# EAGLE design tgam_breakout (EAGLE 6.4)
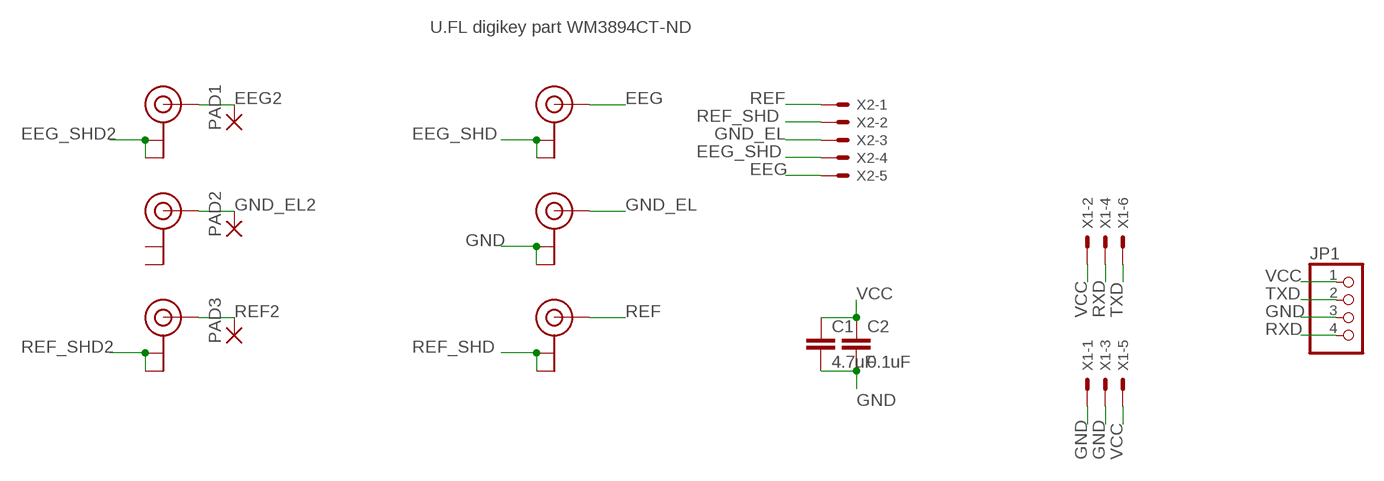
[diagram p0: schematic, sheet 1]

## Parts
C1  4.7uF  C-EUC0805  [C0805]
C2  0.1uF  C-EUC0805  [C0805]
EEG  U.FL  [U.FL]
EEG_EL  U.FL  [U.FL]
GND_EL  U.FL  [U.FL]
GND_ELEL  U.FL  [U.FL]
JP1  PINHD-1X4  [1X04]
PAD1  SMD5  [SMD2,54-5,08]
PAD2  SMD5  [SMD2,54-5,08]
PAD3  SMD5  [SMD2,54-5,08]
REF  U.FL  [U.FL]
REF_EL  U.FL  [U.FL]
X1  332-06  [332-06]
X2  332-10  [2MM5SIL]

## Nets
EEG: EEG.P$3(SIGNAL) X2.9
EEG2: EEG_EL.P$3(SIGNAL) PAD1.1(P)
EEG_SHD: EEG.P$1(GND) EEG.P$2(GND) X2.7
EEG_SHD2: EEG_EL.P$1(GND) EEG_EL.P$2(GND)
GND: C1.2 C2.2 GND_EL.P$1(GND) GND_EL.P$2(GND) JP1.3 X1.1 X1.3
GND_EL: GND_EL.P$3(SIGNAL) X2.5
GND_EL2: GND_ELEL.P$3(SIGNAL) PAD2.1(P)
REF: REF.P$3(SIGNAL) X2.1
REF2: PAD3.1(P) REF_EL.P$3(SIGNAL)
REF_SHD: REF.P$1(GND) REF.P$2(GND) X2.3
REF_SHD2: REF_EL.P$1(GND) REF_EL.P$2(GND)
RXD: JP1.4 X1.4
TXD: JP1.2 X1.6
VCC: C1.1 C2.1 JP1.1 X1.2 X1.5
Unconnected: GND_ELEL.P$1(GND) GND_ELEL.P$2(GND)

## Notes on the sheet
- U.FL digikey part WM3894CT-ND

## Library data of the parts
C1 C2 = rcl:C-EU: CAPACITOR, European symbol
EEG EEG_EL GND_EL GND_ELEL REF REF_EL = SparkFun-Connectors:U.FL: SMD antenna connector- WRL-09144
JP1 = pinhead:PINHD-1X4: PIN HEADER
PAD1-PAD3 = wirepad:SMD5: SMD PAD
X1 = con-garry:332-06: 6 Pin - 2mm Dual Row Source: www.mpe-connector.de / garry_shortform_2012.pdf
X2 = 2mm:332-10: 5 Pin - 2mm Single Row Source: www.mpe-connector.de / garry_shortform_2012.pdf

## Board
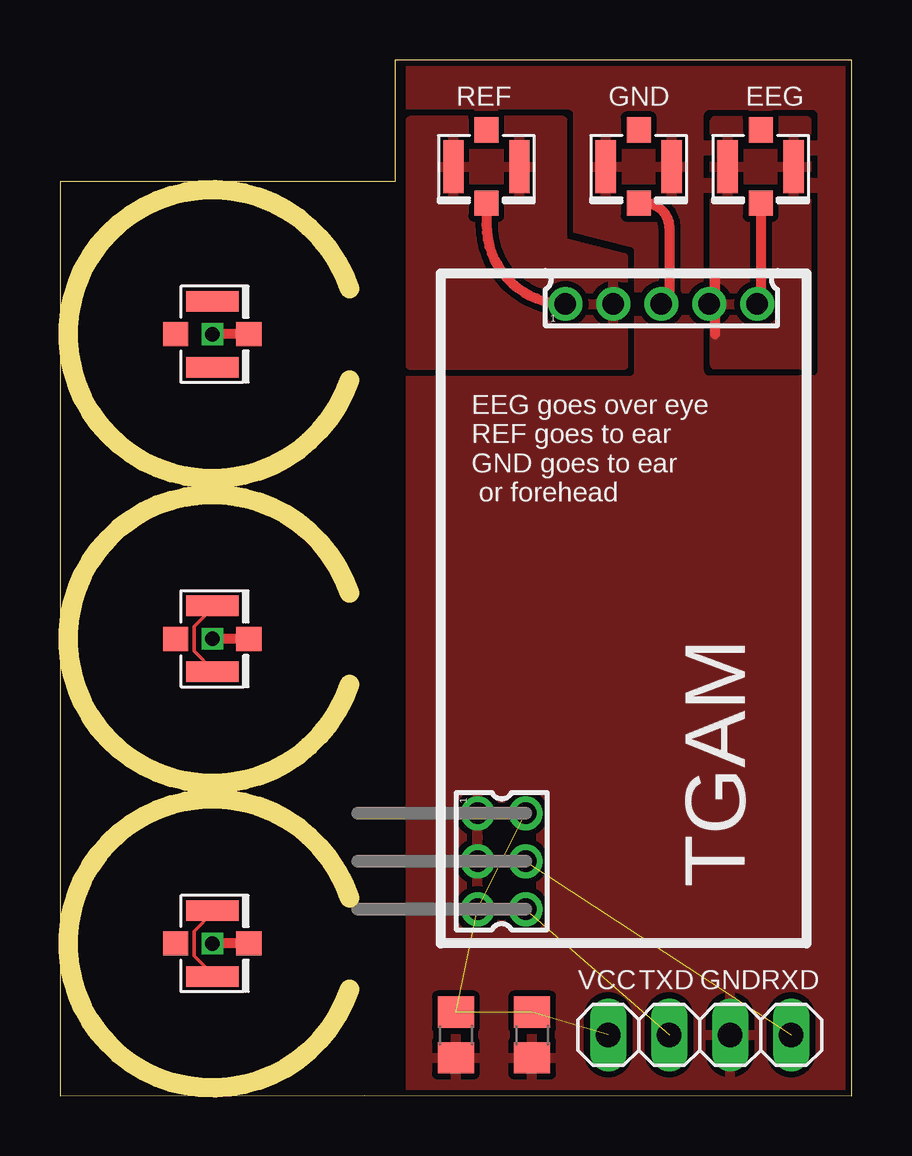
[diagram p1: board, top side]
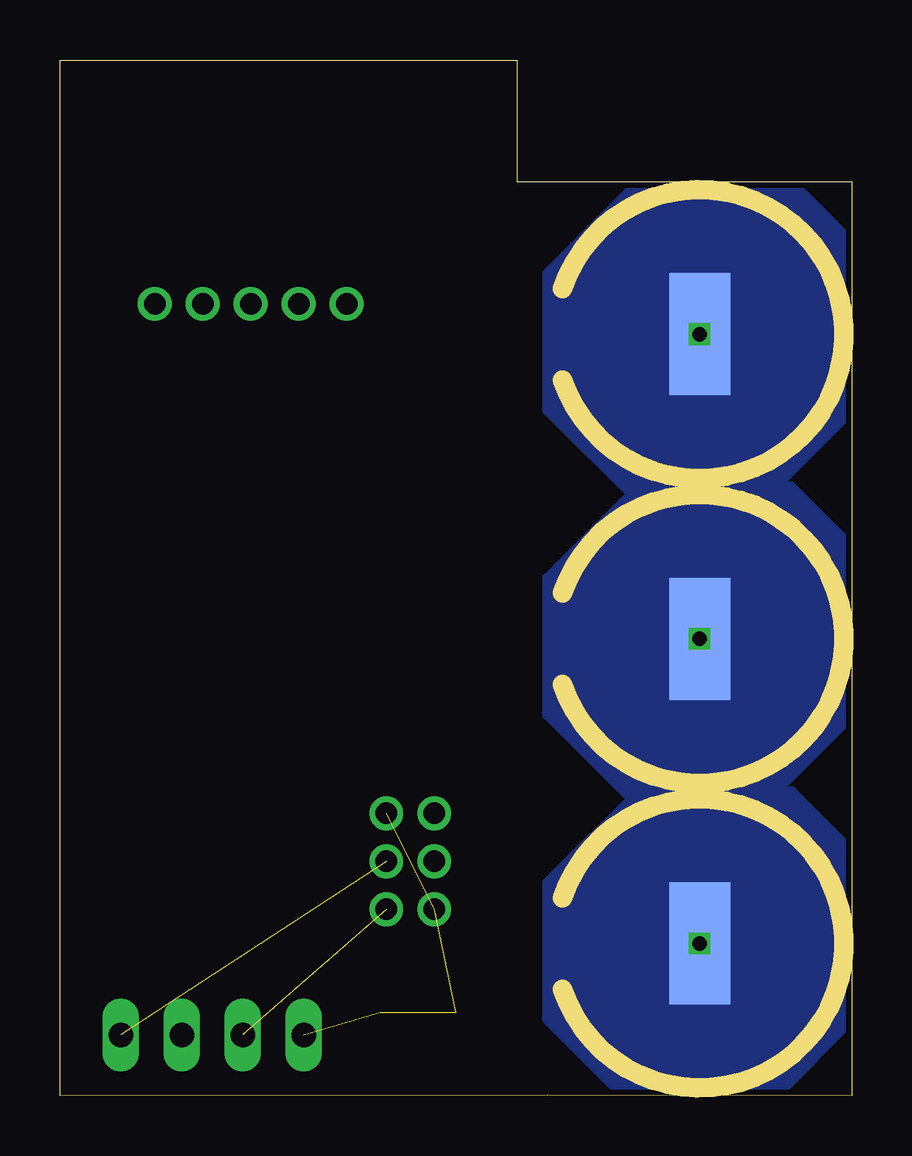
[diagram p2: board, bottom side, seen from below]

Size 33.02 x 43.18 mm. Coordinates in mm from the lower left corner, seen from the top.
Outline: 0,0 12.7,0.02 33.02,0 33.02,43.18 13.97,43.18 13.97,38.1 0,38.1 0,0
Copper layers (1*16): Top 0.035mm / dielectric 1.5mm / Bottom 0.035mm
Design rules "Fusion_eagle_rule_v1.1": minimum track width 6mil, minimum drill 12mil, track to track 6mil, track to pad 6mil, pad to pad 6mil, via to via 6mil, smd to smd 0mil, copper to edge 10mil, drill to drill 10mil, minimum pad ring 10mil, minimum via ring 6mil, stop-mask expansion 2mil, vias tented up to drill 100mil, thermal gap 10mil
Milling: 3 lines

### Footprints (pad centres in the part's own frame; a part is rotated, then mirrored left to right if it is on the bottom)
C0805 = smd 1.3 x 1.5: 1 -0.95,0; 2 0.95,0
U.FL = smd 2.2 x 0.85: P$1 0,1.375; P$2 0,-1.375 | smd 1.05 x 1: P$3 1.525,0; P$4 -1.525,0
1X04 = drill 1.016 long: 1 -3.81,0; 2 -1.27,0; 3 1.27,0; 4 3.81,0
SMD2,54-5,08 = smd 2.54 x 5.08: 1 0,0
332-06 = drill 0.9 pad 1.27: 1 -2,-1; 2 -2,1; 3 0,-1; 4 0,1; 5 2,-1; 6 2,1
2MM5SIL = drill 0.9 pad 1.27: 1 -4,-1; 3 -2,-1; 5 0,-1; 7 2,-1; 9 4,-1

### Placement (x,y rotation side)
C1  16.51,2.54 270 top
C2  19.68,2.54 270 top
EEG  29.21,38.73 270 top
EEG_EL  6.35,19.05 0 top
GND_EL  24.13,38.73 270 top
GND_ELEL  6.35,31.75 0 top
JP1  26.67,2.54 0 top
PAD1  6.35,19.05 0 bottom
PAD2  6.35,31.75 0 bottom
PAD3  6.35,6.35 0 bottom
REF  17.78,38.73 270 top
REF_EL  6.35,6.35 0 top
X1  18.41,9.78 270 top
X2  25.07,34.01 0 top

### Tracks (layer width: path | path; a pad name or v marks a point on that pad's centre or on a via)
EEG
  Top 0.406: EEG.P$3 29.21,33.01 X2.9
EEG2  (via drill 0.6)
  Top 0.406: EEG_EL.P$3 PAD1.1
  other vias: 6.35,19.05
  pour Bottom (isolate 0.254, no thermals): 2.54,25.4 -0.64,22.23 -0.64,16.51 3.81,12.06 8.89,12.06 12.7,15.88 12.7,21.59 8.89,25.4
EEG_SHD
  Top 0.406: 27.3,33.02 27.3,34.29 27.3,31.75
  pour Top (isolate 0.254): 27.3,30.48 27.3,40.64 31.11,40.64 31.11,30.48
EEG_SHD2
  Top 0.152: EEG_EL.P$2 6.35,17.78 5.59,18.54 5.59,19.56 6.35,20.32 EEG_EL.P$1
GND
  pour Top (isolate 0.254, rank 5): 36.2,43.18 14.61,43.18 14.61,-1.27 36.2,-1.27
GND_EL
  Top 0.406: GND_EL.P$3 24.39,37.21 arc-90 25.4,36.2 25.4,33.34 arc-90 X2.5
GND_EL2  (via drill 0.6)
  Top 0.406: GND_ELEL.P$3 PAD2.1
  other vias: 6.35,31.75
  pour Bottom (isolate 0.254, no thermals): 2.54,38.1 -0.64,34.92 -0.64,29.21 3.81,24.77 8.89,24.77 12.7,28.57 12.7,34.29 8.89,38.1
REF
  Top 0.406: REF.P$3 17.78,36.3 arc90 X2.1
REF2  (via drill 0.6)
  Top 0.406: REF_EL.P$3 PAD3.1
  other vias: 6.35,6.35
  pour Bottom (isolate 0.254, no thermals): 2.54,12.7 -0.64,9.53 -0.64,3.81 3.81,-0.64 8.89,-0.64 12.7,3.17 12.7,8.89 8.89,12.7
REF_SHD
  pour Top (isolate 0.254): 20.95,40.64 14.61,40.64 14.61,30.48 23.5,30.48 23.5,34.92 20.95,35.56
REF_SHD2
  Top 0.152: REF_EL.P$2 6.35,5.08 5.59,5.84 5.59,6.86 6.35,7.62 REF_EL.P$1
RXD  (1 unrouted)
TXD  (1 unrouted)
VCC  (4 unrouted)

### Text on the board
tPlace: REF | GND | EEG | EEG goes over eye / REF goes to ear / GND goes to ear / or forehead | TGAM | VCC | TXD | GND | RXD